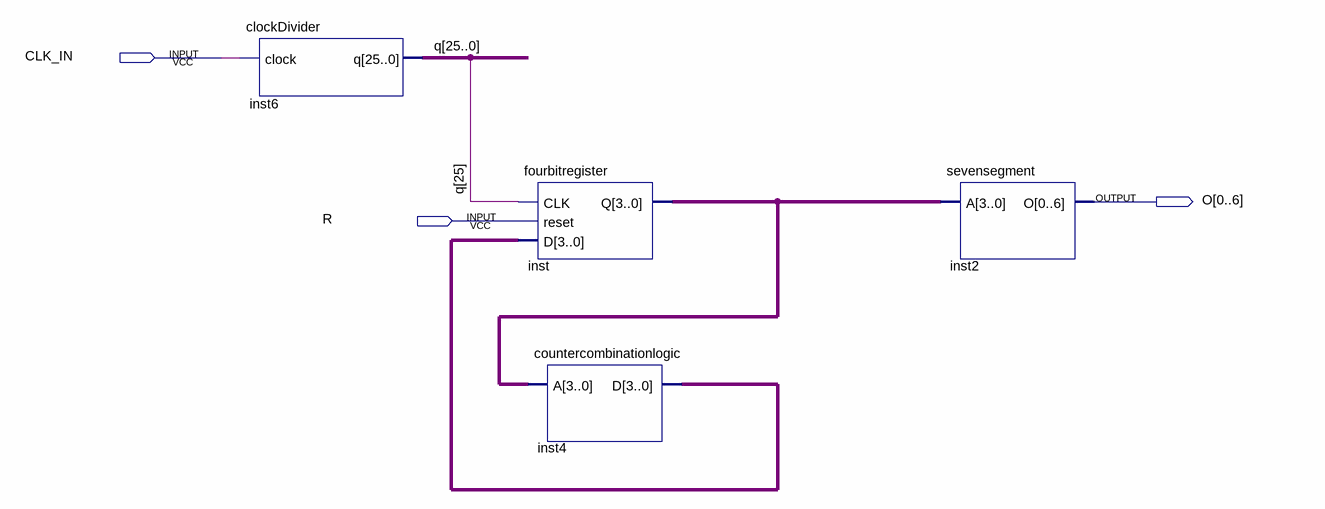
[diagram p0: schematic sheet]
// Quartus schematic counter.bdf as structural Verilog: 4 symbols, 3 pins
module counter (
  input  CLK_IN,
  input  R,
  output [0:6] O
);

  wire [3:0] inst4_d, inst_q;
  wire [25:0] q;

  clockDivider inst6 (.clock(CLK_IN), .q(q));
  fourbitregister inst (.CLK(q[25]), .reset(R), .D(inst4_d), .Q(inst_q));
  countercombinationlogic inst4 (.A(inst_q), .D(inst4_d));
  sevensegment inst2 (.A(inst_q), .O(O));
endmodule
